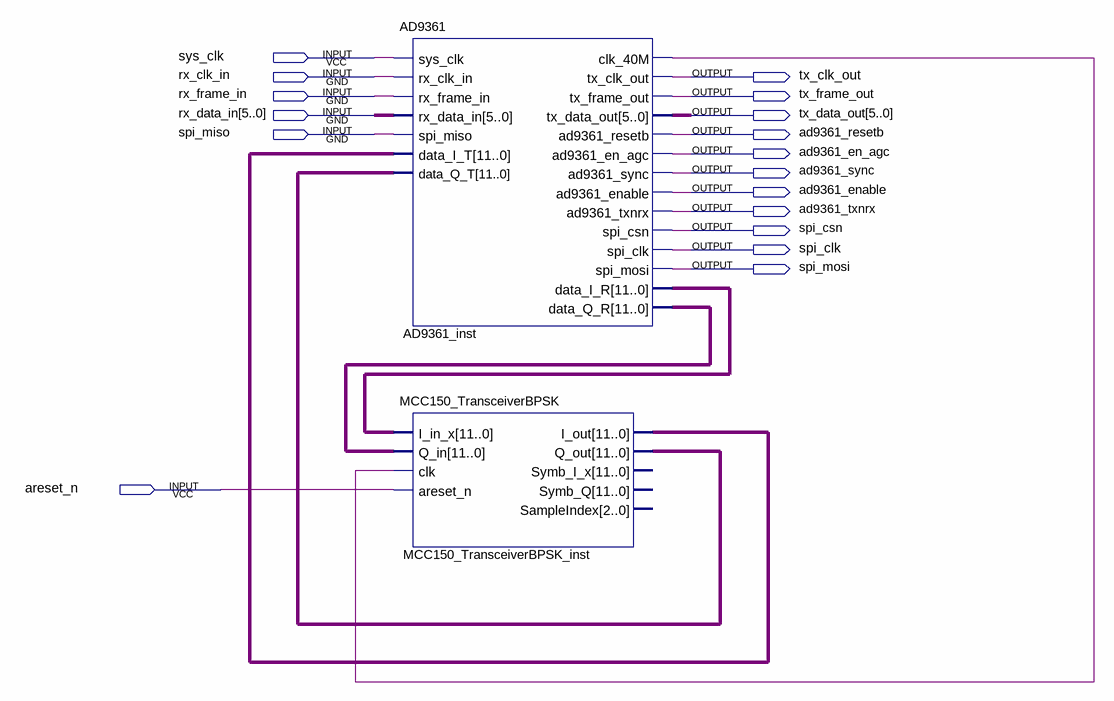
[diagram p0: schematic sheet]
// Quartus schematic MCC150_top.bdf as structural Verilog: 2 symbols, 17 pins
module MCC150_top (
  input  sys_clk,
  input  rx_clk_in,
  input  rx_frame_in,
  input  [5:0] rx_data_in,
  input  spi_miso,
  input  areset_n,
  output tx_clk_out,
  output tx_frame_out,
  output [5:0] tx_data_out,
  output ad9361_resetb,
  output ad9361_en_agc,
  output ad9361_sync,
  output ad9361_enable,
  output ad9361_txnrx,
  output spi_csn,
  output spi_clk,
  output spi_mosi
);

  wire AD9361_inst_clk_40m;
  wire [11:0] AD9361_inst_data_i_r, AD9361_inst_data_q_r, MCC150_TransceiverBPSK_inst_i_out,
       MCC150_TransceiverBPSK_inst_q_out;

  AD9361 AD9361_inst (
    .sys_clk(sys_clk), .rx_clk_in(rx_clk_in), .rx_frame_in(rx_frame_in), .rx_data_in(rx_data_in),
    .spi_miso(spi_miso), .data_I_T(MCC150_TransceiverBPSK_inst_i_out),
    .data_Q_T(MCC150_TransceiverBPSK_inst_q_out), .clk_40M(AD9361_inst_clk_40m), .tx_clk_out(tx_clk_out),
    .tx_frame_out(tx_frame_out), .tx_data_out(tx_data_out), .ad9361_resetb(ad9361_resetb),
    .ad9361_en_agc(ad9361_en_agc), .ad9361_sync(ad9361_sync), .ad9361_enable(ad9361_enable),
    .ad9361_txnrx(ad9361_txnrx), .spi_csn(spi_csn), .spi_clk(spi_clk), .spi_mosi(spi_mosi),
    .data_I_R(AD9361_inst_data_i_r), .data_Q_R(AD9361_inst_data_q_r));
  MCC150_TransceiverBPSK MCC150_TransceiverBPSK_inst (
    .I_in_x(AD9361_inst_data_i_r), .Q_in(AD9361_inst_data_q_r), .clk(AD9361_inst_clk_40m),
    .areset_n(areset_n), .I_out(MCC150_TransceiverBPSK_inst_i_out), .Q_out(MCC150_TransceiverBPSK_inst_q_out));  // open: Symb_I_x, Symb_Q, SampleIndex
endmodule
